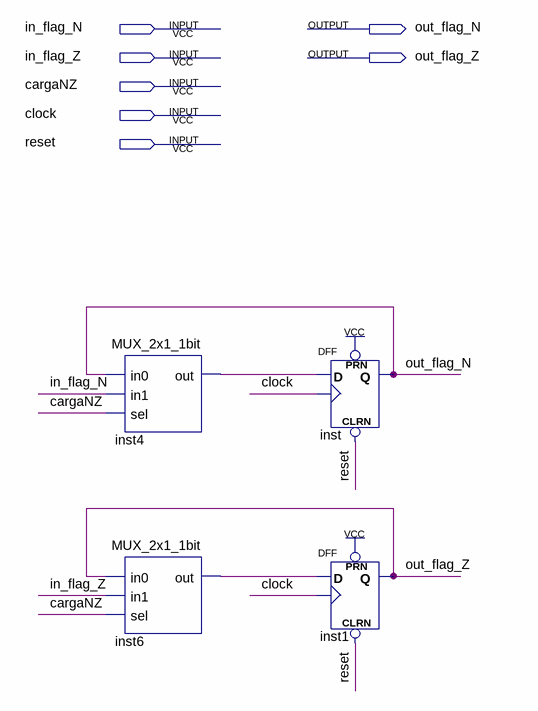
[diagram p0: schematic sheet]
// Quartus schematic NZFlagsRegister.bdf as structural Verilog: 4 symbols, 7 pins
module NZFlagsRegister (
  input  in_flag_N,
  input  in_flag_Z,
  input  cargaNZ,
  input  clock,
  input  reset,
  output out_flag_N,
  output out_flag_Z
);

  wire inst4_out, inst6_out;

  MUX_2x1_1bit inst4 (.in0(out_flag_N), .in1(in_flag_N), .sel(cargaNZ), .out(inst4_out));
  MUX_2x1_1bit inst6 (.in0(out_flag_Z), .in1(in_flag_Z), .sel(cargaNZ), .out(inst6_out));
  DFF inst (.CLRN(reset), .CLK(clock), .D(inst4_out), .PRN(1'b1), .Q(out_flag_N));
  DFF inst1 (.CLRN(reset), .CLK(clock), .D(inst6_out), .PRN(1'b1), .Q(out_flag_Z));
endmodule
